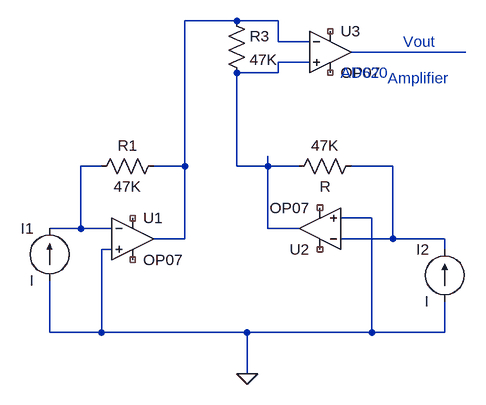
[diagram p0: schematic Current_sense_modelling_Circuit.asc]
Current_sense_modelling_Circuit.asc, the LTspice schematic file:
Version 4
SHEET 1 880 680
WIRE 272 -144 192 -144
WIRE 336 -144 272 -144
WIRE 336 -112 336 -144
WIRE 384 -112 336 -112
WIRE 624 -96 448 -96
WIRE 384 -80 336 -80
WIRE 336 -64 336 -80
WIRE 336 -64 272 -64
WIRE 64 80 32 80
WIRE 192 80 192 -144
WIRE 192 80 144 80
WIRE 272 80 272 -64
WIRE 320 80 320 64
WIRE 320 80 272 80
WIRE 368 80 320 80
WIRE 512 80 448 80
WIRE 480 160 432 160
WIRE 32 176 32 80
WIRE 32 176 -16 176
WIRE 80 176 32 176
WIRE 320 176 320 80
WIRE 368 176 320 176
WIRE 192 192 192 80
WIRE 192 192 144 192
WIRE 512 192 512 80
WIRE 512 192 432 192
WIRE 592 192 512 192
WIRE 80 208 64 208
WIRE 592 208 592 192
WIRE -16 336 -16 256
WIRE 64 336 64 208
WIRE 64 336 -16 336
WIRE 288 336 64 336
WIRE 480 336 480 160
WIRE 480 336 288 336
WIRE 592 336 592 288
WIRE 592 336 480 336
WIRE 288 400 288 336
FLAG 288 400 0
SYMBOL current -16 256 R180
WINDOW 0 24 80 Left 2
WINDOW 3 24 0 Left 2
SYMATTR InstName I1
SYMBOL current 592 288 R180
WINDOW 0 24 80 Left 2
WINDOW 3 24 0 Left 2
SYMATTR InstName I2
SYMBOL OpAmps\\OP07 112 128 R0
SYMATTR InstName U1
SYMBOL res 160 64 R90
WINDOW 0 0 56 VBottom 2
WINDOW 3 32 56 VTop 2
SYMATTR InstName R1
SYMATTR Value 47K
SYMBOL OpAmps\\OP07 400 240 R180
SYMATTR InstName U2
SYMBOL res 464 64 R90
WINDOW 0 0 56 VBottom 2
WINDOW 3 32 56 VTop 2
SYMATTR InstName 47K
SYMBOL OpAmps\\OP07 416 -160 R0
SYMATTR InstName U3
SYMBOL res 256 -160 R0
SYMATTR InstName R3
SYMATTR Value 47K
TEXT 528 -112 Left 2 ;Vout
TEXT 432 -64 Left 2 ;AD620
TEXT 504 -56 Left 2 ;Amplifier

The netlist it stands for:
* Current_sense_modelling_Circuit.asc
I1 0 N004 I
I2 0 N005 I
XU1 0 N004 NC_01 NC_02 N001 LT1001  ; OP07, pins In+ In- V+ V- OUT
R1 N001 N004 47K
XU2 0 N005 NC_03 NC_04 N003 LT1001  ; OP07, pins In+ In- V+ V- OUT
R§47K N005 N003 R
XU3 N003 N001 NC_05 NC_06 N002 LT1001  ; OP07, pins In+ In- V+ V- OUT
R3 N001 N003 47K
* Vout
* AD620
* Amplifier
.lib LTC.lib
.backanno
.end